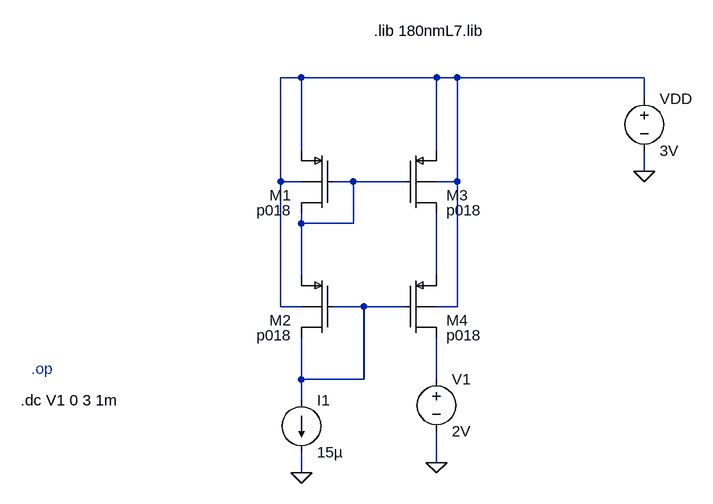
[diagram p0: schematic ogl-cascodaP-MOS.asc]
ogl-cascodaP-MOS.asc, the LTspice schematic file:
Version 4
SHEET 1 1144 932
WIRE -288 160 -320 160
WIRE -80 160 -288 160
WIRE -48 160 -80 160
WIRE 240 160 -48 160
WIRE 240 192 240 160
WIRE -288 272 -288 160
WIRE -80 272 -80 160
WIRE 240 304 240 272
WIRE -320 320 -320 160
WIRE -288 320 -320 320
WIRE -208 320 -240 320
WIRE -128 320 -208 320
WIRE -48 320 -48 160
WIRE -48 320 -80 320
WIRE -288 384 -288 368
WIRE -208 384 -208 320
WIRE -208 384 -288 384
WIRE -288 464 -288 384
WIRE -80 464 -80 368
WIRE -320 512 -320 320
WIRE -288 512 -320 512
WIRE -192 512 -240 512
WIRE -128 512 -192 512
WIRE -48 512 -48 320
WIRE -48 512 -80 512
WIRE -288 624 -288 560
WIRE -192 624 -192 512
WIRE -192 624 -288 624
WIRE -80 624 -80 560
WIRE -288 656 -288 624
WIRE -80 752 -80 704
WIRE -288 768 -288 736
FLAG 240 304 0
FLAG -288 768 0
FLAG -80 752 0
SYMBOL voltage 240 176 R0
WINDOW 123 0 0 Left 2
WINDOW 39 0 0 Left 2
SYMATTR InstName VDD
SYMATTR Value 3V
SYMBOL pmosb -128 272 R0
SYMATTR InstName M3
SYMATTR Value p018
SYMATTR Value2 l=1u w=7.42u ad=1.48p as=1.48p pd=15.24u ps=15.24u m=1
SYMBOL pmosb -128 464 R0
SYMATTR InstName M4
SYMATTR Value p018
SYMATTR Value2 l=1u w=9.6u ad=1.92p as=1.92p pd=19.6u ps=19.6u m=1
SYMBOL pmosb -240 464 M0
SYMATTR InstName M2
SYMATTR Value p018
SYMATTR Value2 l=1u w=8.8u ad=1.76p as=1.76p pd=18u ps=18u m=1
SYMBOL pmosb -240 272 M0
SYMATTR InstName M1
SYMATTR Value p018
SYMATTR Value2 l=1u w=7.42u ad=1.48p as=1.48p pd=15.24u ps=15.24u m=1
SYMBOL voltage -80 608 R0
WINDOW 123 0 0 Left 0
WINDOW 39 0 0 Left 0
SYMATTR InstName V1
SYMATTR Value 2V
SYMBOL current -288 656 R0
WINDOW 123 0 0 Left 0
WINDOW 39 0 0 Left 0
SYMATTR InstName I1
SYMATTR Value 15µ
TEXT -176 88 Left 2 !.lib 180nmL7.lib
TEXT -704 608 Left 2 ;.op
TEXT -720 656 Left 2 !.dc V1 0 3 1m

The netlist it stands for:
* ogl-cascodaP-MOS.asc
VDD N001 0 3V
M3 N003 N002 N001 N001 p018 l=1u w=7.42u ad=1.48p as=1.48p pd=15.24u ps=15.24u m=1
M4 N005 N004 N003 N001 p018 l=1u w=9.6u ad=1.92p as=1.92p pd=19.6u ps=19.6u m=1
M2 N004 N004 N002 N001 p018 l=1u w=8.8u ad=1.76p as=1.76p pd=18u ps=18u m=1
M1 N002 N002 N001 N001 p018 l=1u w=7.42u ad=1.48p as=1.48p pd=15.24u ps=15.24u m=1
V1 N005 0 2V
I1 N004 0 15µ
.model NMOS NMOS
.model PMOS PMOS
.lib standard.mos
.lib 180nmL7.lib
* .op
.dc V1 0 3 1m
.backanno
.end